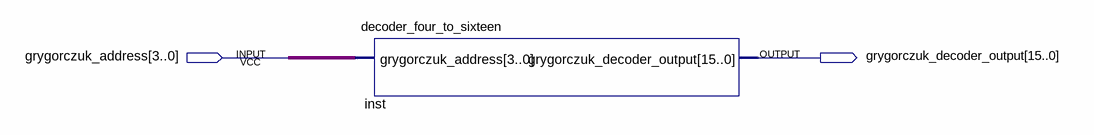
[diagram p0: schematic sheet]
// Quartus schematic FOUR_TO_SIXTEEN_DECODER.bdf as structural Verilog: 1 symbols, 2 pins
module FOUR_TO_SIXTEEN_DECODER (
  input  [3:0] grygorczuk_address,
  output [15:0] grygorczuk_decoder_output
);

  decoder_four_to_sixteen inst (
    .grygorczuk_address(grygorczuk_address), .grygorczuk_decoder_output(grygorczuk_decoder_output));
endmodule
